# EAGLE design HB-Dis-EP-42BW_V1.0 (EAGLE 9.4.2)
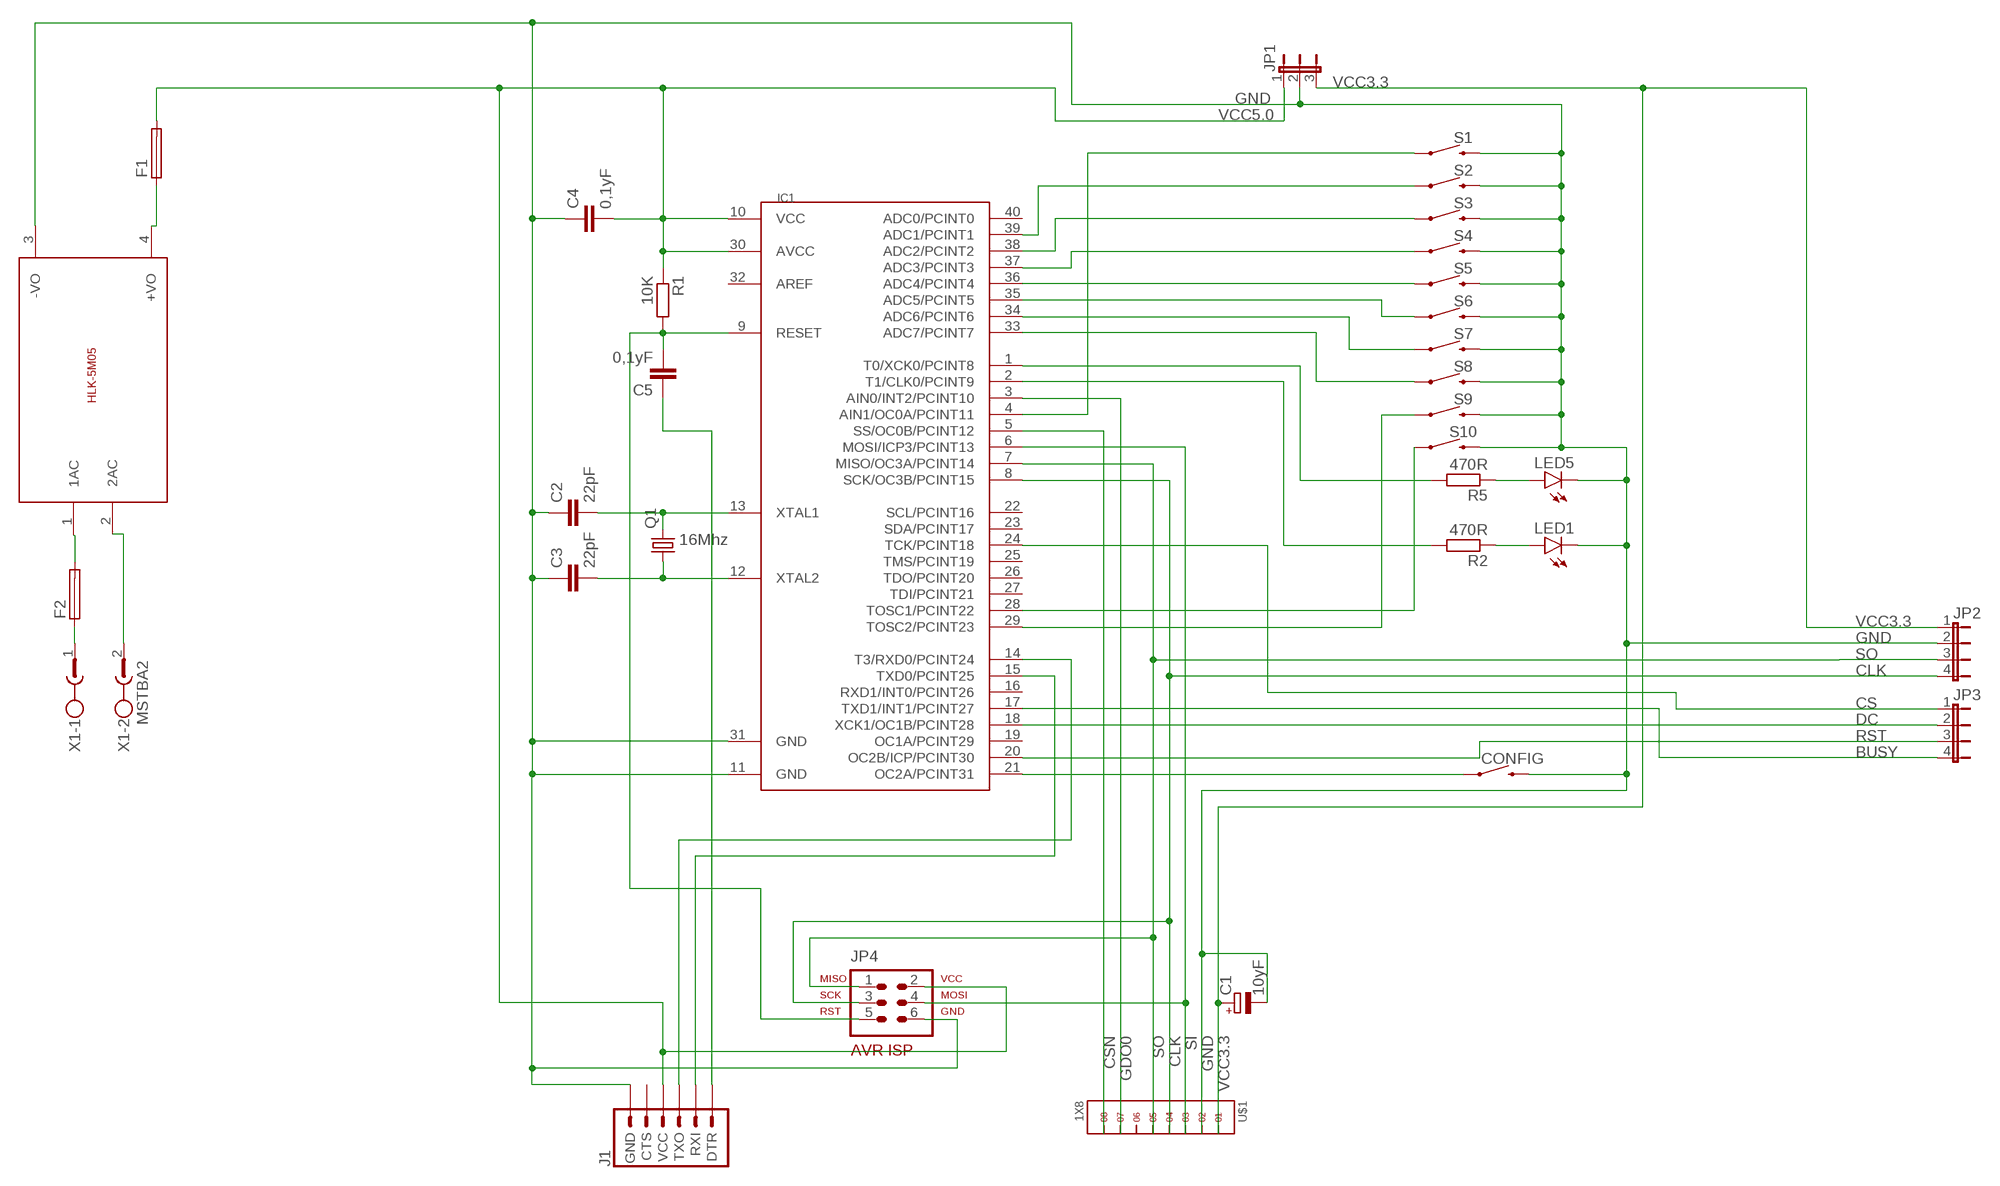
[diagram p0: schematic, sheet 1]

## Parts
C1  10yF  CPOL-EUE2.5-5  [E2,5-5]
C2  22pF  C-EU025-024X044  [C025-024X044]
C3  22pF  C-EU025-024X044  [C025-024X044]
C4  0,1yF  C-EU025-024X044  [C025-024X044]
C5  0,1yF  C-EU025-024X044  [C025-024X044]
CONFIG  MOMENTARY-SWITCH-SPST-PTH-6.0MM-KIT  [TACTILE_SWITCH_PTH_6.0MM_KIT]
F1  SH22,5A  [SH22,5A]
F2  SH22,5A  [SH22,5A]
IC1  MEGA1284P  [DIL40]
J1  6_PIN_SERIAL_TARGETLONGPADS  [1X06_LONGPADS]
JP1  JP2E  [JP2]
JP2  JP4E  [JP4]
JP3  JP4E  [JP4]
JP4  AVR-ISP-6VERT  [AVR-ISP-6]
LED1  LED3MM  [LED3MM]
LED5  LED3MM  [LED3MM]
Q1  16Mhz  CRYSTALHC49U-V  [HC49U-V]
R1  10K  R-EU_0309/10  [0309/10]
R2  470R  R-EU_0309/10  [0309/10]
R5  470R  R-EU_0309/10  [0309/10]
S1  MOMENTARY-SWITCH-SPST-PTH-6.0MM-KIT  [TACTILE_SWITCH_PTH_6.0MM_KIT]
S2  MOMENTARY-SWITCH-SPST-PTH-6.0MM-KIT  [TACTILE_SWITCH_PTH_6.0MM_KIT]
S3  MOMENTARY-SWITCH-SPST-PTH-6.0MM-KIT  [TACTILE_SWITCH_PTH_6.0MM_KIT]
S4  MOMENTARY-SWITCH-SPST-PTH-6.0MM-KIT  [TACTILE_SWITCH_PTH_6.0MM_KIT]
S5  MOMENTARY-SWITCH-SPST-PTH-6.0MM-KIT  [TACTILE_SWITCH_PTH_6.0MM_KIT]
S6  MOMENTARY-SWITCH-SPST-PTH-6.0MM-KIT  [TACTILE_SWITCH_PTH_6.0MM_KIT]
S7  MOMENTARY-SWITCH-SPST-PTH-6.0MM-KIT  [TACTILE_SWITCH_PTH_6.0MM_KIT]
S8  MOMENTARY-SWITCH-SPST-PTH-6.0MM-KIT  [TACTILE_SWITCH_PTH_6.0MM_KIT]
S9  MOMENTARY-SWITCH-SPST-PTH-6.0MM-KIT  [TACTILE_SWITCH_PTH_6.0MM_KIT]
S10  MOMENTARY-SWITCH-SPST-PTH-6.0MM-KIT  [TACTILE_SWITCH_PTH_6.0MM_KIT]
U$1  1X8  [1X8]
U$3  5VDC/5W  HLK-5M05  [HLK-5M05]
X1  MSTBA2  [MSTBA2]

## Nets
BUSY: IC1.17(TXD1/INT1/PCINT27) JP3.4
CLK: IC1.8(SCK/OC3B/PCINT15) JP2.4 JP4.3 U$1.4
CS: IC1.24(TCK/PCINT18) JP3.1
CSN: IC1.5(SS/OC0B/PCINT12) U$1.8
DC: IC1.18(XCK1/OC1B/PCINT28) JP3.2
GDO0: IC1.3(AIN0/INT2/PCINT10) U$1.7
GND: C1.- C2.1 C3.1 C4.1 CONFIG.3 IC1.11(GND) IC1.31(GND) J1.6(GND) JP1.2 JP2.2 JP4.6 LED1.K(C) LED5.K(C) S1.3 S2.3 S3.3 S4.3 S5.3 S6.3 S7.3 S8.3 S9.3 S10.3 U$1.2 U$3.3(-VO)
N$1: C2.2 IC1.13(XTAL1) Q1.2
N$2: C3.2 IC1.12(XTAL2) Q1.1
N$3: C5.1 J1.1(DTR)
N$4: LED1.A R2.1
N$5: F2.1 X1.1
N$6: U$3.2(2AC) X1.2
N$7: F2.2 U$3.1(1AC)
N$8: F1.1 U$3.4(+VO)
N$9: C5.2 IC1.9(RESET) JP4.5 R1.2
N$10: IC1.15(TXD0/PCINT25) J1.2(RXI)
N$11: LED5.A R5.1
N$12: IC1.4(AIN1/OC0A/PCINT11) S1.1
N$13: IC1.14(T3/RXD0/PCINT24) J1.3(TXO)
N$19: IC1.39(ADC1/PCINT1) S2.1
N$20: IC1.38(ADC2/PCINT2) S3.1
N$21: IC1.37(ADC3/PCINT3) S4.1
N$22: IC1.36(ADC4/PCINT4) S5.1
N$23: IC1.35(ADC5/PCINT5) S6.1
N$24: IC1.34(ADC6/PCINT6) S7.1
N$25: IC1.33(ADC7/PCINT7) S8.1
N$26: IC1.28(TOSC1/PCINT22) S10.1
N$27: IC1.29(TOSC2/PCINT23) S9.1
N$28: CONFIG.1 IC1.21(OC2A/PCINT31)
N$29: IC1.1(T0/XCK0/PCINT8) R5.2
N$30: IC1.2(T1/CLK0/PCINT9) R2.2
RST: IC1.20(OC2B/ICP/PCINT30) JP3.3
SI: IC1.6(MOSI/ICP3/PCINT13) JP4.4 U$1.3
SO: IC1.7(MISO/OC3A/PCINT14) JP2.3 JP4.1 U$1.5
VCC3.3: C1.+ JP1.3 JP2.1 U$1.1
VCC5.0: C4.2 F1.2 IC1.10(VCC) IC1.30(AVCC) J1.4(VCC) JP1.1 JP4.2 R1.1
Unconnected: IC1.16(RXD1/INT0/PCINT26) IC1.19(OC1A/PCINT29) IC1.22(SCL/PCINT16) IC1.23(SDA/PCINT17) IC1.25(TMS/PCINT19) IC1.26(TDO/PCINT20) IC1.27(TDI/PCINT21) IC1.32(AREF) IC1.40(ADC0/PCINT0) J1.5(CTS) U$1.6

## Library data of the parts
C1 = resistor:CPOL-EU: POLARIZED CAPACITOR, European symbol
C2-C5 = resistor:C-EU: CAPACITOR, European symbol
CONFIG S1-S10 = SparkFun-Switches:MOMENTARY-SWITCH-SPST: Momentary Switch (Pushbutton) - SPST Normally-open (NO) SPST momentary switches (buttons, pushbuttons). Variants PTH-12MM - 12mm square, through-hole Momentary Pushbutton Switch - 12mm Square <https://www.sparkfun.com/products/9190> (COM-09190) PTH-6.0MM, PTH-6.0MM-KIT - 6.0mm square, through-hole Mini Pushbutton Switch <https://www.sparkfun.com/products/97> (COM-00097) KIT package intended for soldering kit's - only one side of pads' copper is exposed. PTH-RIGHT-ANGLE-KIT - Right-angle, through-hole Right Angle Tactile Button <https://www.sparkfun.com/products/10791> - Used on SparkFun BigTime Watch Kit <https://www.sparkfun.com/products/11734> SMD-12MM - 12mm square, surface-mount Tactile Button - SMD (12mm) <https://www.sparkfun.com/products/12993> (COM-12993) Used on SparkFun PicoBoard <https://www.sparkfun.com/products/11888> SMD-4.5MM - 4.5mm Square Trackball Switch Used on SparkFun Blackberry Trackballer Breakout <https://www.sparkfun.com/products/13169> SMD-4.6MMX2.8MM - 4.60mm x 2.80mm, surface mount Used on SparkFun SAMD21 Mini Breakout <https://www.sparkfun.com/products/13664> SMD-5.2MM, SMD-5.2-REDUNDANT - 5.2mm square, surface-mount Mini Pushbutton Switch - SMD <https://www.sparkfun.com/products/8720> (COM-08720) Used on Arduino Pro Mini <https://www.sparkfun.com/products/11114> REDUNDANT package connects both switch circuits together SMD-6.0X3.5MM - 6.0 x 3.5mm, surface mount Momentary Reset Switch SMD <https://www.sparkfun.com/products/8229> (COM-08229) SMD-6.2MM-TALL - 6.2mm square, surface mount Tactile Button - SMD (6mm) <https://www.sparkfun.com/products/12992> Used on SparkFun Digital Sandbox <https://www.sparkfun.com/products/12651> SMD-RIGHT-ANGLE - Right-angle, surface mount Used on SparkFun Block for Intel® Edison - Arduino <https://www.sparkfun.com/products/13036>; PROD_ID: SWCH-08441; SF_SKU: COM-00097
F1 F2 = fuse:SH22,5A: FUSE HOLDER grid 22,5mm, isolated cap OGN0031 8201, Schurter (Buerklin); MPN: 0031.7701.11; OC_FARNELL: unknown; OC_NEWARK: 04F1224
IC1 = 1284p:MEGA1284P: Atmel ATmega1284P 8-bit AVR Microcontroller
J1 = SparkFun-Connectors:6_PIN_SERIAL_TARGET: 6-pin header connection for use with the "FTDI BASIC" pinout - TARGET SIDE. Also known as "Arduino Serial Program Header". It is used to mate with our FTDI Basic serial programmers using the Arduino IDE. Note, this device has "TARGET" in the name. It is intended to be used on a design that contains a target micro-controller that you wish to program. The "sister" device, named "CABLE" is inteneded to be used on a design that usually lives on the end of your USB cable and prvides the converter chip (FTDI232 or FTDI231x) to commnicate serial RX/TX. You can populate with some of these: Break Away Headers - Straight <https://www.sparkfun.com/products/116> (PRT-00116) For reference (or to suit your programming needs) check out these designs: SparkFun FTDI Basic Breakout - 5V <https://www.sparkfun.com/products/9716> (DEV-09716) SparkFun FTDI Basic Breakout - 3.3V <https://www.sparkfun.com/products/9873> (DEV-09873) SparkFun FTDI SmartBasic <https://www.sparkfun.com/products/12935> (DEV-12935) SparkFun Beefy 3 - FTDI Basic Breakout <https://www.sparkfun.com/products/13746> (DEV-13746)
JP1 = jumper:JP2E: JUMPER
JP2 JP3 = jumper:JP4E: JUMPER
JP4 = avr-7:AVR-ISP-6: AVR ISP-6 Serial Programming Header
LED1 LED5 = led:LED: LED OSRAM: - CHIPLED LG R971, LG N971, LY N971, LG Q971, LY Q971, LO R971, LY R971 LH N974, LH R974 LS Q976, LO Q976, LY Q976 LO Q996 - Hyper CHIPLED LW Q18S LB Q993, LB Q99A, LB R99A - SideLED LS A670, LO A670, LY A670, LG A670, LP A670 LB A673, LV A673, LT A673, LW A673 LH A674 LY A675 LS A676, LA A676, LO A676, LY A676, LW A676 LS A679, LY A679, LG A679 - Hyper Micro SIDELED® LS Y876, LA Y876, LO Y876, LY Y876 LT Y87S - SmartLED LW L88C, LW L88S LB L89C, LB L89S, LG L890 LS L89K, LO L89K, LY L89K LS L896, LA L896, LO L896, LY L896 - TOPLED LS T670, LO T670, LY T670, LG T670, LP T670 LSG T670, LSP T670, LSY T670, LOP T670, LYG T670 LG T671, LOG T671, LSG T671 LB T673, LV T673, LT T673, LW T673 LH T674 LS T676, LA T676, LO T676, LY T676, LB T676, LH T676, LSB T676, LW T676 LB T67C, LV T67C, LT T67C, LS T67K, LO T67K, LY T67K, LW E67C LS E67B, LA E67B, LO E67B, LY E67B, LB E67C, LV E67C, LT E67C LW T67C LS T679, LY T679, LG T679 LS T770, LO T770, LY T770, LG T770, LP T770 LB T773, LV T773, LT T773, LW T773 LH T774 LS E675, LA E675, LY E675, LS T675 LS T776, LA T776, LO T776, LY T776, LB T776 LHGB T686 LT T68C, LB T68C - Hyper Mini TOPLED® LB M676 - Mini TOPLED Santana® LG M470 LS M47K, LO M47K, LY M47K Source: http://www.osram.convergy.de LUXEON: - LUMILED® LXK2-PW12-R00, LXK2-PW12-S00, LXK2-PW14-U00, LXK2-PW14-V00 LXK2-PM12-R00, LXK2-PM12-S00, LXK2-PM14-U00 LXK2-PE12-Q00, LXK2-PE12-R00, LXK2-PE12-S00, LXK2-PE14-T00, LXK2-PE14-U00 LXK2-PB12-K00, LXK2-PB12-L00, LXK2-PB12-M00, LXK2-PB14-N00, LXK2-PB14-P00, LXK2-PB14-Q00 LXK2-PR12-L00, LXK2-PR12-M00, LXK2-PR14-Q00, LXK2-PR14-R00 LXK2-PD12-Q00, LXK2-PD12-R00, LXK2-PD12-S00 LXK2-PH12-R00, LXK2-PH12-S00 LXK2-PL12-P00, LXK2-PL12-Q00, LXK2-PL12-R00 Source: www.luxeon.com KINGBRIGHT: KA-3528ASYC Source: www.kingbright.com
Q1 = crystal:CRYSTAL: CRYSTAL; OC_FARNELL: 1666969; OC_NEWARK: unknown
R1 R2 R5 = resistor:R-EU_: RESISTOR, European symbol
U$1 = headers(2mm):1X8
U$3 = HLK-5M05:HLK-5M05: HLK-5M05 is an 5Volt/5W smps developed by HI-LINK; SIZE: 23x38(mm)
X1 = con-phoenix-508:MSTBA2: PHOENIX; MF: FARNELL; MPN: 1757242; OC_FARNELL: 3705171; OC_NEWARK: 71C4161

## Board
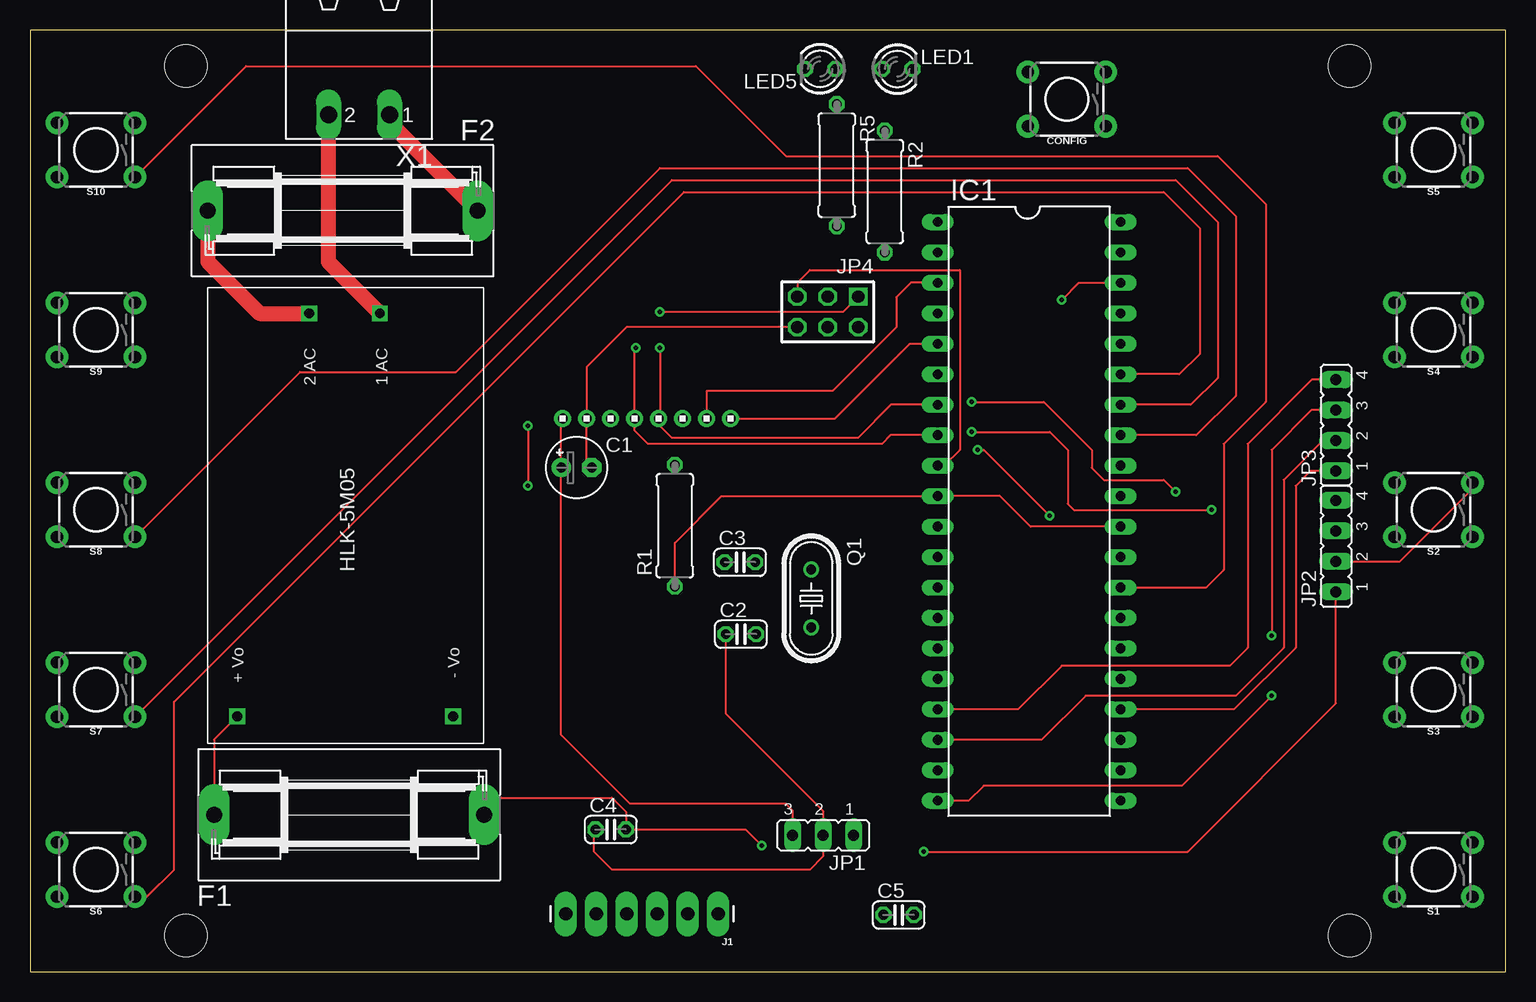
[diagram p1: board, top side]
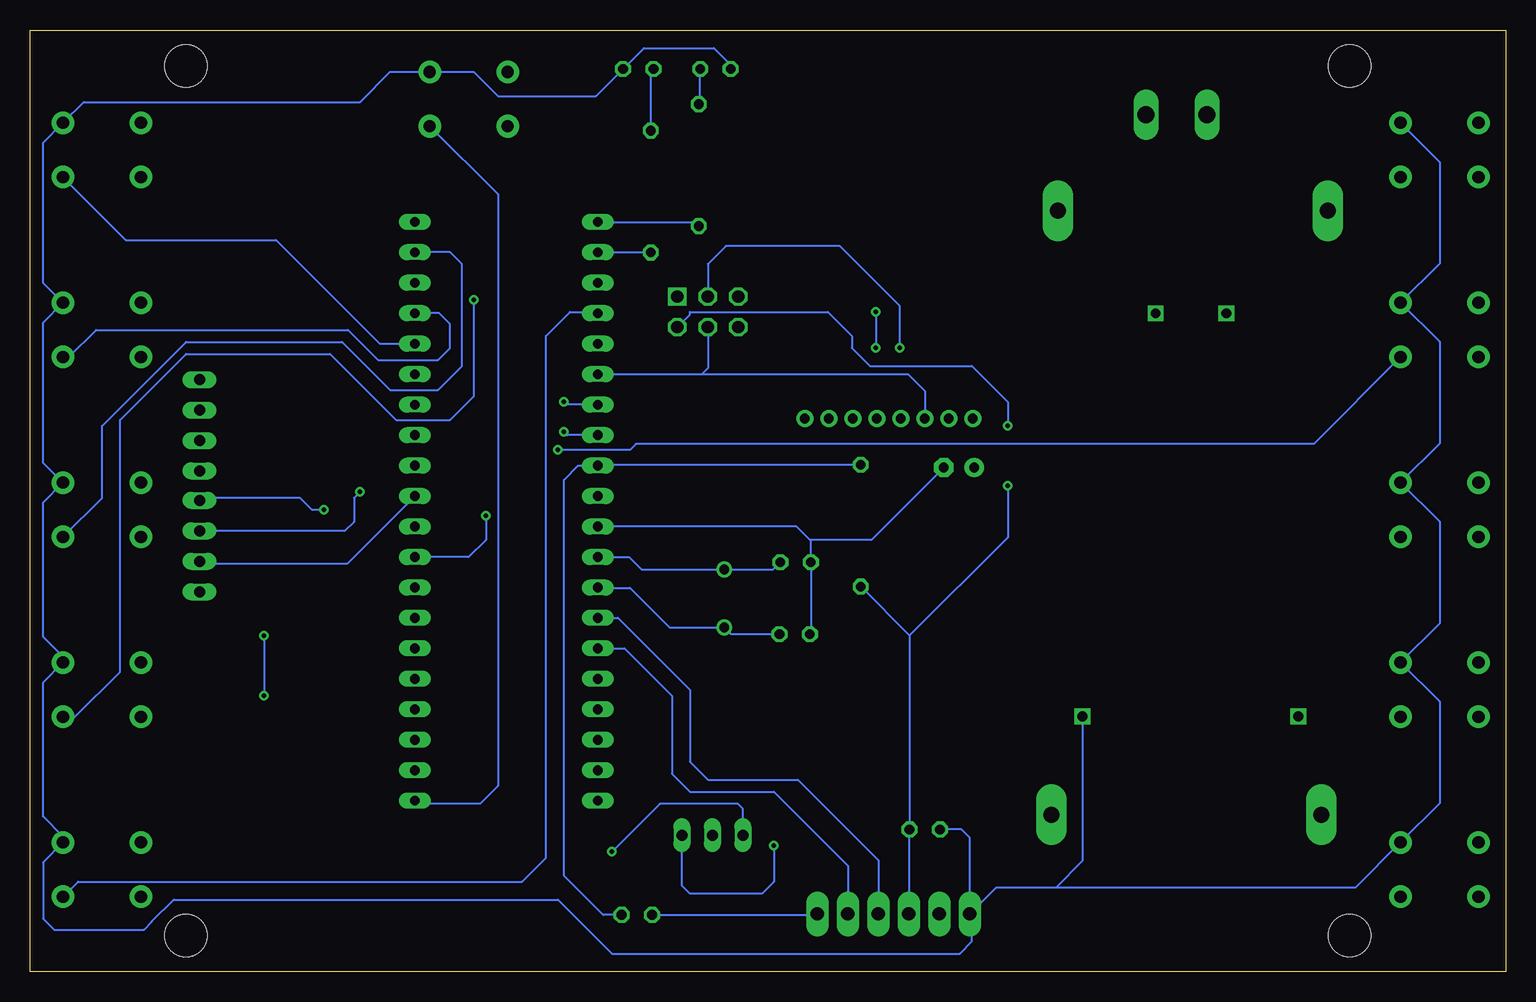
[diagram p2: board, bottom side, seen from below]

Size 123 x 78.5 mm. Coordinates in mm from the lower left corner, seen from the top.
Outline: 123,78.5 0,78.5 0,0 123,0 123,78.5
Copper layers (1*16): Top 0.035mm / dielectric 1.5mm / Bottom 0.035mm
Design rules "default": minimum track width 6mil, minimum drill 0.35mm, track to track 6mil, track to pad 6mil, pad to pad 6mil, via to via 6mil, smd to smd 6mil, copper to edge 40mil, drill to drill 6mil, minimum pad ring 10mil, minimum via ring 8mil, stop-mask expansion 4mil, vias tented up to drill 0mil, thermal gap 10mil
Holes 3.5 mm at 110,75.5 13,75.5 110,3 13,3

### Footprints (pad centres in the part's own frame; a part is rotated, then mirrored left to right if it is on the bottom)
E2,5-5 = drill 0.813 pad 1.6: + -1.27,0 | drill 0.813 pad 1.6 octagon: - 1.27,0
C025-024X044 = drill 0.813 octagon: 1 -1.27,0; 2 1.27,0
TACTILE_SWITCH_PTH_6.0MM_KIT = drill 1.016 pad 1.88: 1 -3.251,2.261; 2 3.251,2.261; 3 -3.251,-2.261; 4 3.251,-2.261
SH22,5A = drill 1.321 pad 2.54 long: 1 -11.252,0; 2 11.252,0
DIL40 = drill 0.813 long: 1 -24.13,-7.62; 2 -21.59,-7.62; 3 -19.05,-7.62; 4 -16.51,-7.62; 5 -13.97,-7.62; 6 -11.43,-7.62; 7 -8.89,-7.62; 8 -6.35,-7.62; 9 -3.81,-7.62; 10 -1.27,-7.62; 11 1.27,-7.62; 12 3.81,-7.62; 13 6.35,-7.62; 14 8.89,-7.62; 15 11.43,-7.62; 16 13.97,-7.62; 17 16.51,-7.62; 18 19.05,-7.62; 19 21.59,-7.62; 20 24.13,-7.62; 21 24.13,7.62; 22 21.59,7.62; 23 19.05,7.62; 24 16.51,7.62; 25 13.97,7.62; 26 11.43,7.62; 27 8.89,7.62; 28 6.35,7.62; 29 3.81,7.62; 30 1.27,7.62; 31 -1.27,7.62; 32 -3.81,7.62; 33 -6.35,7.62; 34 -8.89,7.62; 35 -11.43,7.62; 36 -13.97,7.62; 37 -16.51,7.62; 38 -19.05,7.62; 39 -21.59,7.62; 40 -24.13,7.62
1X06_LONGPADS = drill 1.118 pad 1.88 long: 1 0,0; 2 2.54,0; 3 5.08,0; 4 7.62,0; 5 10.16,0; 6 12.7,0
JP2 = drill 0.914 long: 1 -2.54,0; 2 0,0; 3 2.54,0
JP4 = drill 0.914 long: 1 -3.81,0; 2 -1.27,0; 3 1.27,0; 4 3.81,0
AVR-ISP-6 = drill 1.016 square: 1 -2.54,-1.27 | drill 1.016 octagon: 2 -2.54,1.27; 3 0,-1.27; 4 0,1.27; 5 2.54,-1.27; 6 2.54,1.27
LED3MM = drill 0.813 octagon: A -1.27,0; K 1.27,0
HC49U-V = drill 0.813: 1 -2.413,0; 2 2.413,0
0309/10 = drill 0.813 octagon: 1 -5.08,0; 2 5.08,0
1X8 = drill 0.8 pad 1.422: 1 -7,0; 2 -5,0; 3 -3,0; 4 -1,0; 5 1,0; 6 3,0; 7 5,0; 8 7,0
HLK-5M05 = drill 0.8 square: 1 -16.85,-2.93; 2 -16.85,2.97; 3 16.75,9.07; 4 16.75,-8.93
MSTBA2 = drill 1.397 long: 1 -2.54,5.08; 2 2.54,5.08

### Placement (x,y rotation side)
C1  45.56,42.02 0 top
C2  59.26,28.13 0 top
C3  59.18,34.13 0 top
C4  48.41,11.84 0 top
C5  72.41,4.72 0 top
CONFIG  86.43,72.74 180 top
F1  26.6,13.07 0 top
F2  26.07,63.43 180 top
IC1  83.29,38.37 270 top
J1  57.36,4.81 180 top
JP1  66.12,11.37 180 top
JP2  108.87,35.47 90 top
JP3  108.87,45.54 90 top
JP4  66.5,55 180 top
LED1  72.3,75.25 0 top
LED5  65.86,75.25 180 top
Q1  65.13,31.1 270 top
R1  53.75,37.17 90 top
R2  71.25,65.03 270 top
R5  67.25,67.23 270 top
S1  117,8.5 180 top
S2  117,38.5 180 top
S3  117,23.5 180 top
S4  117,53.5 180 top
S5  117,68.5 180 top
S6  5.5,8.5 180 top
S7  5.5,23.5 180 top
S8  5.5,38.5 180 top
S9  5.5,53.5 180 top
S10  5.5,68.5 180 top
U$1  51.41,46.1 0 top
U$3  26.2,38.02 270 top
X1  27.43,76.52 180 top

### Tracks (layer width: path | path; a pad name or v marks a point on that pad's centre or on a via)
BUSY
  Top 0.152: JP3.4 106.85,49.35 101.5,44 101.5,27 100,25.5 86,25.5 82.36,21.86 IC1.17
CLK  (via drill 0.35)
  Top 0.152: IC1.8 71.72,44.72 71,44 51.5,44 50.41,45.09 U$1.4 50.41,51.91 v50.5,52 | v78.5,45 85,45 86.5,43.5 86.5,39 87,38.5 v98.5,38.5
  Bottom 0.152: v50.5,52 50.5,55.5 55.5,60.5 65,60.5 66.5,59 JP4.3 | IC1.8 78.22,44.72 v78.5,45 | v98.5,38.5 99.5,38.5 100.5,39.5 108.65,39.5 JP2.4
CS
  Top 0.152: JP3.1 106.73,41.73 105.5,40.5 105.5,27 100.36,21.86 IC1.24
CSN
  Top 0.152: IC1.5 73.34,52.34 67.1,46.1 U$1.8
DC
  Top 0.152: JP3.2 107.77,44.27 104.5,41 104.5,27 100.5,23 88,23 84.32,19.32 IC1.18
GDO0
  Top 0.152: U$1.7 56.41,48.41 66.91,48.41 72.21,53.71 72.21,56.21 73.42,57.42 IC1.3
GND
  Top 0.152: JP2.2 114.2,34.2 120.25,40.25 S2.3 | C2.1 57.99,21.51 66.12,13.38 JP1.2 66.12,9.62 65,8.5 48.5,8.5 47,10 47,11.7 C4.1 | C1.- 46.41,42.44 U$1.2 46.41,50.41 49.73,53.73 JP4.6
  Bottom 0.152: LED5.K 64.59,75.59 66,77 71.82,77 LED1.K 75.82,73 84,73 86,75 CONFIG.3 93,75 95.5,72.5 118.51,72.5 S5.3 121.91,69.1 121.91,57.41 121.5,57 121.49,57 S4.3 121.91,54.1 121.91,42.41 S2.3 121.91,39.1 121.91,27.91 120.25,26.25 S3.3 121.91,24.1 121.91,12.92 120.25,11.26 S1.3 121.91,9.1 121.91,4.41 121,3.5 113.5,3.5 112.84,4.16 112.84,4.18 111.02,6 79,6 74.5,1.5 45.5,1.5 44.48,2.51 44.48,4.99 | IC1.31 96.55,34 108.67,34 JP2.2 | C2.1 57.91,28.21 C3.1 57.91,35.91 58,36 | IC1.11 59.1,37.1 58,36 | C1.- 52.85,36 58,36 | S10.3 5.5,67.5 5.5,59.01 S9.3 5.5,52.51 5.5,44.01 S8.3 5.5,37.51 5.5,29.01 S7.3 5.5,22.51 5.5,14.01 S6.3 12.51,7 37.5,7 | 44.48,4.99 42.47,7 37.5,7 | 44.48,4.99 J1.6 44.66,11.16 45.34,11.84 C4.1 | U$3.3 35.27,9.23 37.5,7
N$1
  Bottom 0.152: IC1.13 75.65,32 73,32 69.69,28.69 Q1.2 64.57,28.13 C2.2
N$2
  Bottom 0.152: IC1.12 73.06,34.56 72.01,33.51 Q1.1 61.07,33.51 C3.2
N$3
  Bottom 0.152: C5.1 57.45,4.72 J1.1
N$4
  Bottom 0.152: R2.1 71.25,75.03 LED1.A
N$5
  Top 1.27: F2.1 29.97,70.78 X1.1
N$6
  Top 1.27: U$3.2 24.89,59.15 X1.2
N$7
  Top 1.27: F2.2 14.82,59.18 19.13,54.87 U$3.1
N$8
  Top 0.152: U$3.4 15.35,19.35 F1.1
N$9
  Top 0.152: JP4.5 64,56.31 64,57.5 65,58.5 77.5,58.5 77.5,43.5 76.18,42.18 IC1.9
  Bottom 0.152: C5.2 75.22,4.72 78.5,8 78.5,41 77.32,42.18 IC1.9 75.6,42.25 R1.2
N$10
  Bottom 0.152: IC1.15 73.44,26.94 69.5,23 69.5,16.5 68,15 61,15 54.82,8.82 J1.2
N$11
  Bottom 0.152: R5.1 67.13,72.43 LED5.A
N$12
  Bottom 0.152: S1.1 118.99,7.5 82,7.5 80,9.5 80,53 78,55 75.79,55 IC1.4
N$13
  Bottom 0.152: IC1.14 73.98,29.48 68,23.5 68,17.5 66.5,16 59,16 52.28,9.28 J1.3
N$19
  Bottom 0.152: S2.1 117,39.49 117,45.5 110,52.5 97,52.5 93,48.5 89,48.5 87,50.5 87,59 88,60 90.87,60 IC1.39
N$20  (via drill 0.35)
  Top 0.152: v86,56 87.42,57.42 IC1.38
  Bottom 0.152: S3.1 119.26,21.24 115.5,25 115.5,46 110,51.5 98,51.5 92.5,46 88,46 86,48 v86,56
N$21
  Bottom 0.152: S4.1 119.76,51.24 117.5,53.5 96.5,53.5 94,51 89,51 88,52 88,54 88.88,54.88 IC1.37
N$22
  Bottom 0.152: S5.1 115.01,61 102.5,61 93.84,52.34 IC1.36
N$23
  Top 0.152: S6.1 9.74,6.24 12,8.5 12,22.5 54.5,65 94.5,65 97.5,62 97.5,51.5 95.8,49.8 IC1.35
N$24
  Top 0.152: S7.1 53.51,66 95.5,66 99,62.5 99,49.5 96.76,47.26 IC1.34
N$25
  Top 0.152: S8.1 22.51,50 35.5,50 52.5,67 96.5,67 100.5,63 100.5,48 97.22,44.72 IC1.33
N$26
  Top 0.152: S10.1 18.01,75.5 55.5,75.5 63,68 99,68 103,64 103,47.5 99.5,44 99.5,33.5 98,32 90.93,32 IC1.28
N$27  (via drill 0.35)
  Top 0.152: v79,43.5 79.5,43.5 v85,38
  Bottom 0.152: S9.1 15.99,44 72.5,44 73,43.5 v79,43.5 | v85,38 85,36 86.44,34.56 IC1.29
N$28
  Bottom 0.152: CONFIG.1 84,64.8 84,15.5 85.5,14 90.67,14 IC1.21
N$29
  Bottom 0.152: IC1.1 67.6,62.5 R5.2
N$30
  Bottom 0.152: IC1.2 R2.2
RST  (via drill 0.35)
  Top 0.152: JP3.3 106.81,46.81 103.5,43.5 v103.5,28 | v103.5,23 96,15.5 79.5,15.5 78.24,14.24 IC1.20
  Bottom 0.152: v103.5,28 v103.5,23
SI
  Bottom 0.152: IC1.6 67,49.8 | 67,49.8 49.8,49.8 48.41,48.41 U$1.3 | JP4.4 66.5,50.3 67,49.8
SO  (via drill 0.35)
  Top 0.152: IC1.7 71.76,47.26 69,44.5 53.5,44.5 52.41,45.59 U$1.5 52.5,46.19 v52.5,52 | JP4.1 67.77,55 v52.5,55 | v78.5,47.5 84.5,47.5 88.5,43.5 88.5,42 89.5,41 94.5,41 v95.5,40
  Bottom 0.152: v52.5,55 v52.5,52 | IC1.7 78.26,47.26 v78.5,47.5 | v95.5,40 96,39.5 96,37.5 96.76,36.74 JP2.3
VCC3.3  (via drill 0.35)
  Top 0.152: U$1.1 44.29,45.98 C1.+ 44.29,19.71 50,14 63,14 63.58,13.42 JP1.3 | v74.5,10 96.5,10 108.87,22.37 JP2.1
  Bottom 0.152: JP1.3 63.58,13.58 64,14 70.5,14 v74.5,10
VCC5.0  (via drill 0.35)
  Top 0.152: R1.1 53.75,35.75 57.64,39.64 IC1.10 80.86,39.64 83.4,37.1 IC1.30 | F1.2 39.28,14.5 48.5,14.5 49.68,13.32 C4.2 59.66,11.84 v61,10.5 | v41.5,45.5 v41.5,40.5
  Bottom 0.152: J1.4 49.68,4.87 C4.2 49.68,28.02 | R1.1 49.68,28.02 | v61,10.5 61,7.5 62,6.5 68,6.5 68.66,7.16 JP1.1 | JP4.2 68,54.77 68,55 56.5,55 54.5,53 54.5,52 53,50.5 44.5,50.5 41.5,47.5 v41.5,45.5 | v41.5,40.5 41.5,36.2 49.68,28.02